# Altium schematic sheet 1_MCU-BLE.SchDoc
size B; SheetNumber: 1; SheetTotal: 1
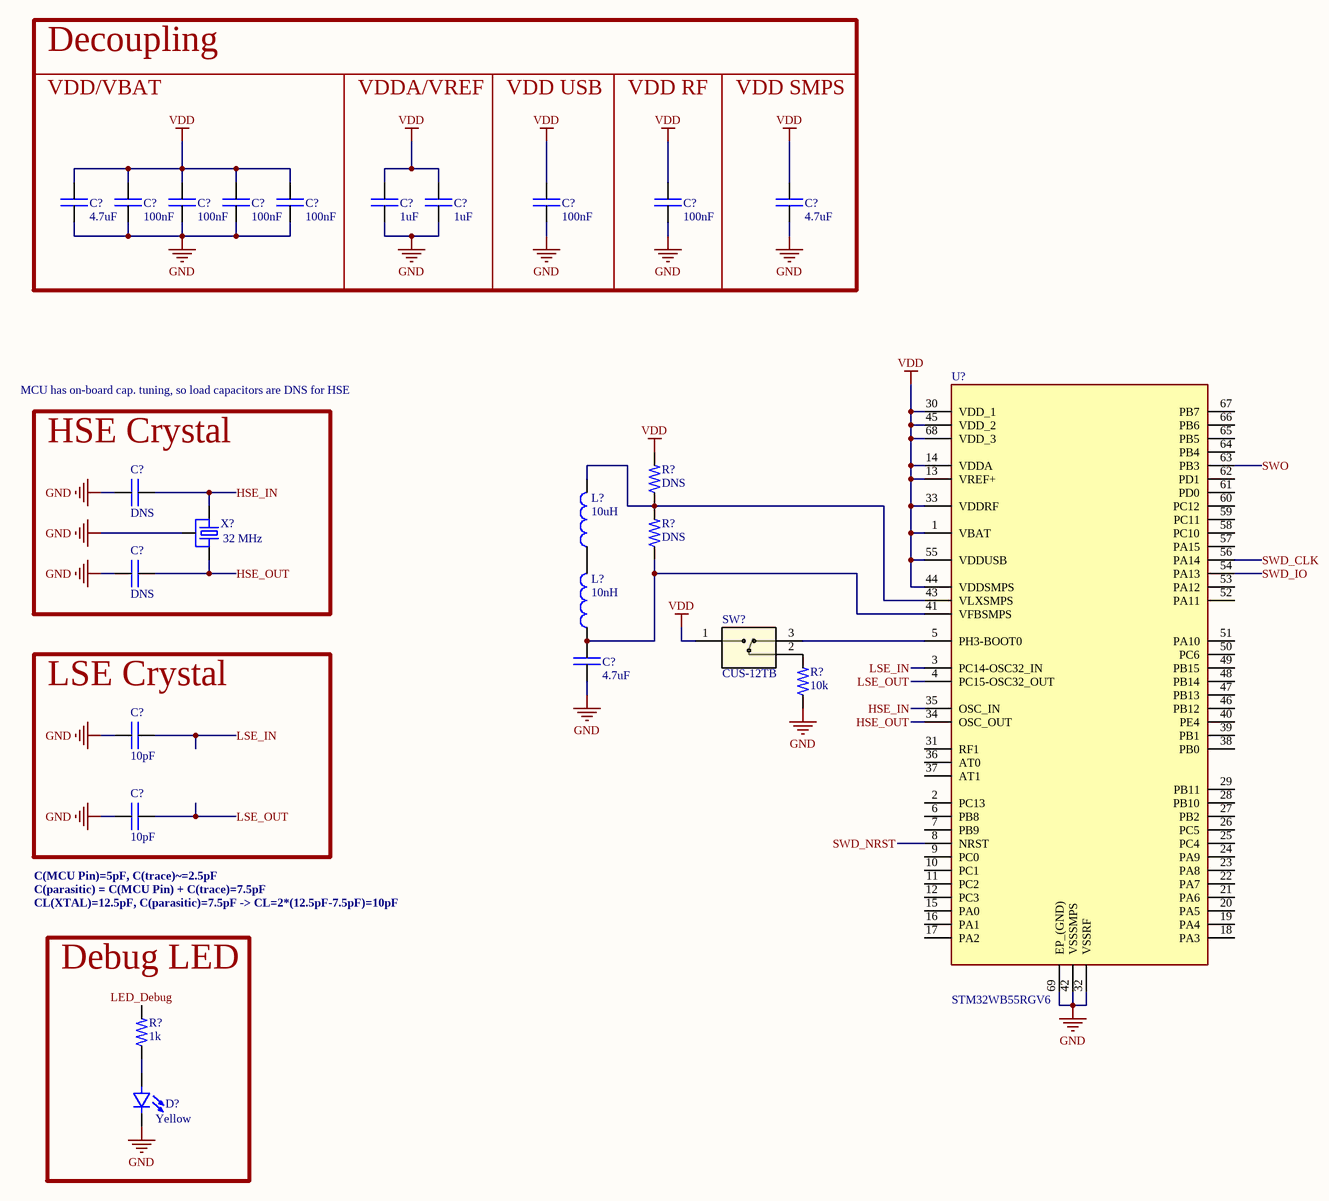
[diagram p0: 1_MCU-BLE.SchDoc]

## Parts
(Parts that share a designator on the sheet are numbered #1, #2 ... from top to bottom, then left to right.)
C?#1  value 4.7uF  [0402C]  (hidden comment: CAP)
C?#2  value 100nF  [0402C]  (hidden comment: CAP)
C?#3  value 100nF  [0402C]  (hidden comment: CAP)
C?#4  value 100nF  [0402C]  (hidden comment: CAP)
C?#5  value 100nF  [0402C]  (hidden comment: CAP)
C?#6  value 1uF  [0402C]  (hidden comment: CAP)
C?#7  value 1uF  [0402C]  (hidden comment: CAP)
C?#8  value 100nF  [0402C]  (hidden comment: CAP)
C?#9  value 100nF  [0402C]  (hidden comment: CAP)
C?#10  value 4.7uF  [0402C]  (hidden comment: CAP)
C?#11  value DNS  [0402C]  (hidden comment: CAP)
C?#12  value DNS  [0402C]  (hidden comment: CAP)
C?#13  value 4.7uF  [0402C]  (hidden comment: CAP)
C?#14  value 10pF  [0402C]  (hidden comment: CAP)
C?#15  value 10pF  [0402C]  (hidden comment: CAP)
D?  Color: Yellow  [0603-LED]  (hidden comment: LED - single)
L?#1  value 10uH  (hidden comment: IND)
L?#2  value 10nH  (hidden comment: IND)
R?#1  value DNS  [0402R]  (hidden comment: RES)
R?#2  value DNS  [0402R]  (hidden comment: RES)
R?#3  value 10k  [0402R]  (hidden comment: RES)
R?#4  value 1k  [0402R]  (hidden comment: RES)
SW?  CUS-12TB  [CUS-12TB_NDC]
U?  STM32WB55RGV6  [VQFN-68]
X?  Frequency: 32 MHz  [32MHZ_SMD1612-4P]  (hidden comment: XTAL-OSC_32MHz)

## Blocks framed on the sheet
Decoupling: C?#1-C?#5
VDDA/VREF: C?#6 C?#7
VDD USB: C?#8
VDD RF: C?#9
VDD SMPS: C?#10
HSE Crystal: C?#11 C?#12 X?
LSE Crystal: C?#14 C?#15
Debug LED: D? R?#4

## Nets
GND: C?#1.1 C?#2.1 C?#3.1 C?#4.1 C?#5.1 C?#6.1 C?#7.1 C?#8.1 C?#9.1 C?#10.1 C?#11.2 C?#12.2 C?#13.1 C?#14.2 C?#15.2 D?.2(C) R?#3.1 U?.32(VSSRF) U?.42(VSSSMPS) U?.69(EP_(GND)) X?.GND
VDD: C?#1.2 C?#2.2 C?#3.2 C?#4.2 C?#5.2 C?#6.2 C?#7.2 C?#8.2 C?#9.2 C?#10.2 R?#1.2 SW?.1 U?.1(VBAT) U?.13(VREF+) U?.14(VDDA) U?.30(VDD_1) U?.33(VDDRF) U?.44(VDDSMPS) U?.45(VDD_2) U?.55(VDDUSB) U?.68(VDD_3)
HSE_IN: C?#11.1 U?.35(OSC_IN) X?.1
HSE_OUT: C?#12.1 U?.34(OSC_OUT) X?.3
LED_Debug: R?#4.2
LSE_IN: C?#14.1 U?.3(PC14-OSC32_IN)
LSE_OUT: C?#15.1 U?.4(PC15-OSC32_OUT)
SWD_CLK: U?.56(PA14)
SWD_IO: U?.54(PA13)
SWD_NRST: U?.8(NRST)
SWO: U?.63(PB3)
NetC?#13_2: C?#13.2 L?#2.1 R?#2.1 U?.41(VFBSMPS)
NetD?_1: D?.1(A) R?#4.1
NetL?#1_1: L?#1.1 L?#2.2
NetL?#1_2: L?#1.2 R?#1.1 R?#2.2 U?.43(VLXSMPS)
NetR?#3_2: R?#3.2 SW?.2
NetSW?_3: SW?.3 U?.5(PH3-BOOT0)

Not connected (* = marked no-connect by the designer): U? 2(PC13) 6(PB8) 7(PB9) 9(PC0) 10(PC1) 11(PC2) 12(PC3) 15(PA0) 16(PA1) 17(PA2) 18(PA3) 19(PA4) 20(PA5) 21(PA6) 22(PA7) 23(PA8) 24(PA9) 25(PC4) 26(PC5) 27(PB2) 28(PB10) 29(PB11) 31(RF1) 36(AT0) 37(AT1) 38(PB0) 39(PB1) 40(PE4) 46(PB12) 47(PB13) 48(PB14) 49(PB15) 50(PC6) 51(PA10) 52(PA11) 53(PA12) 57(PA15) 58(PC10) 59(PC11) 60(PC12) 61(PD0) 62(PD1) 64(PB4) 65(PB5) 66(PB6) 67(PB7)

## Notes on the sheet
- VDD/VBAT
- MCU has on-board cap. tuning, so load capacitors are DNS for HSE
- CL(XTAL)=12.5pF, C(parasitic)=7.5pF -> CL=2*(12.5pF-7.5pF)=10pF
- C(MCU Pin)=5pF, C(trace)~=2.5pF
- C(parasitic) = C(MCU Pin) + C(trace)=7.5pF

## Library data of the parts
C?#1-C?#13 = CAP: Capaicitor; MFR: *; MFR PN: *
C?#14 C?#15 = CAP: Capaicitor; MFR PN: FN15N100J500PNG; MFR: *; JLCPCB PN: C328913
D? = LED - single: LED; Value: 19-213/Y2C-CQ2R2L/3T(CY); MFR: *; MFR PN: *; JLCPCB PN: C72038
L?#1 L?#2 = IND: INDUCTOR; JLCPCB PN: *; Footprint: *
R?#1-R?#4 = RES: Resistor; MFR PN: *; MFR: *; Type: SMD
SW? = SPDT SLIDE SWITCH: JLC Alternate: / SSSS811101; MFR: Nidec Copal Electronics; MFR PN: CUS-12TB; Type: SMD
U? = STM32WB55RGV6: ARM Microcontrollers - MCU Ultra-low-power dual core Arm Cortex-M4 MCU 64 MHz, Cortex-M0 32MHz with 1 Mbyte Flash, BLE, 802.15.4, USB, LCD, AES-256; MFR: STMicroelectronics; Value: STM32WB55RGV6; JLCPCB Part #: *
X? = XTAL-OSC_32MHz: SMD Tuning Fork Crystal; MFR PN: Murata; Value: XRCMD32M000FXP50R0; Type: SMD; JLCPCB PN: C341820